# Altium schematic sheet Promless.SchDoc: FPGA Configuration and GBTx I/O
size A; Organization: UCLA High Energy Physics; DocumentNumber: 10; Revision: 2.0; SheetNumber: 10; SheetTotal: 23; CurrentDate: 9/6/2018; ModifiedDate: 9/6/2018
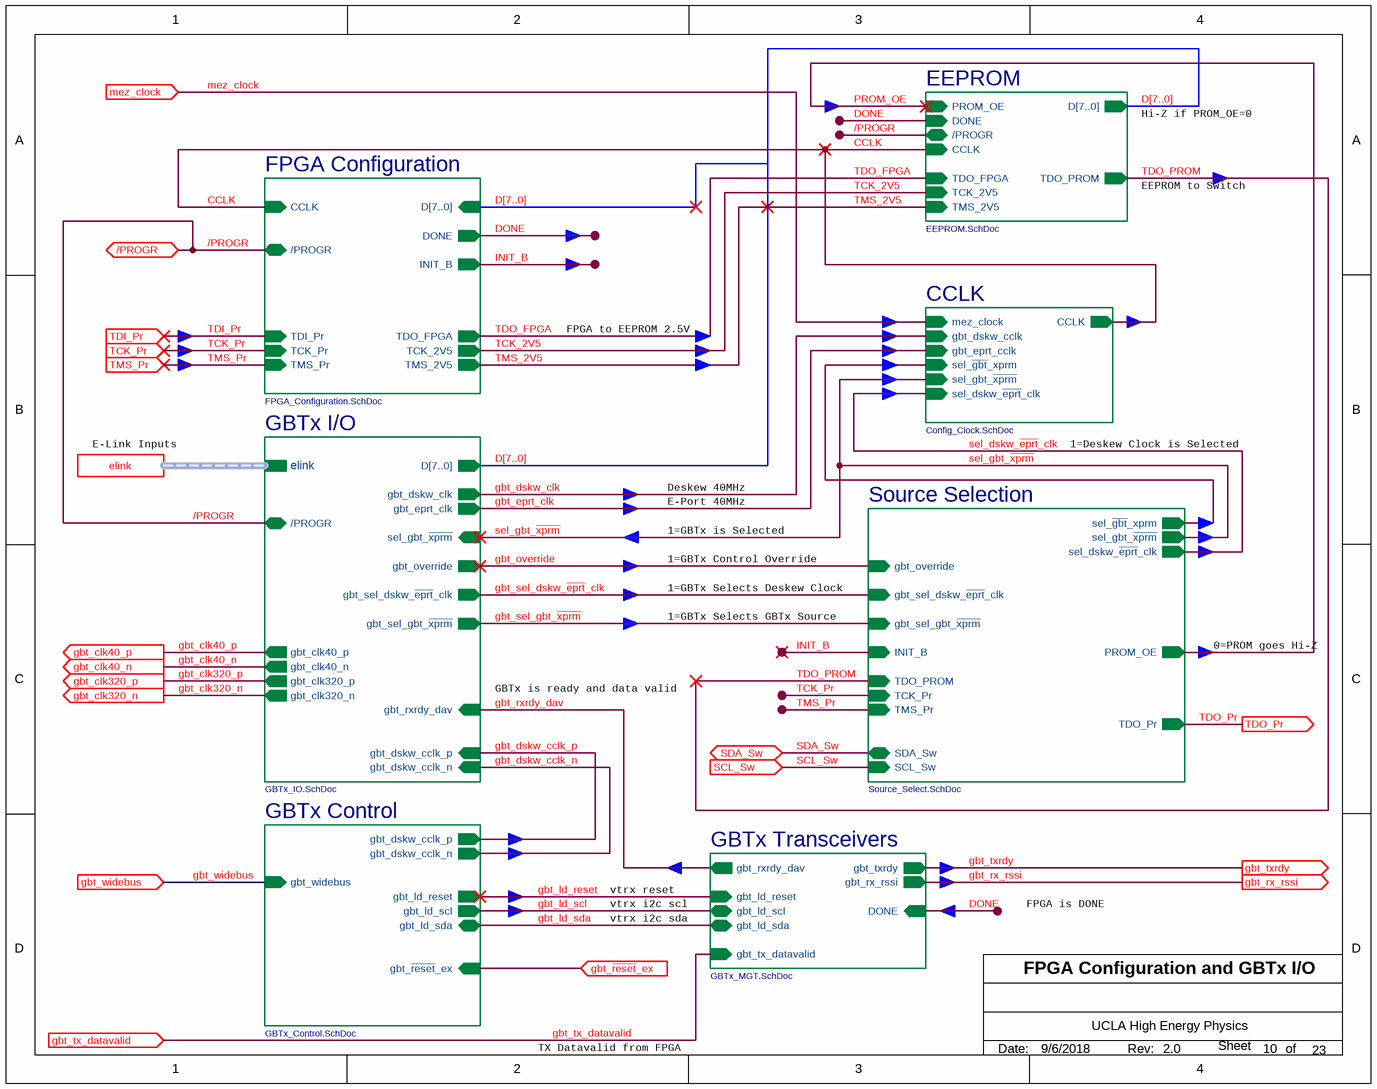
[diagram p0: Promless.SchDoc]

## Sub-sheets
CCLK = Config_Clock.SchDoc: CCLK (out), sel_gbt_~{xprm} (in), mez_clock (in), gbt_dskw_cclk (in), gbt_eprt_cclk (in), sel_dskw_~{eprt}_clk (in), sel_~{gbt}_xprm (in)
EEPROM = EEPROM.SchDoc: PROM_OE (in), DONE (in), /PROGR (bidir), D[7..0] (out), TCK_2V5 (in), TDO_FPGA (in), TMS_2V5 (in), TDO_PROM (out), CCLK (in)
FPGA Configuration = FPGA_Configuration.SchDoc: TDO_FPGA (out), TDI_Pr (in), TCK_Pr (in), TMS_Pr (in), /PROGR (bidir), DONE (out), CCLK (in), D[7..0] (in), TCK_2V5 (out), TMS_2V5 (out), INIT_B (out)
GBTx Control = GBTx_Control.SchDoc: gbt_dskw_cclk_p (out), gbt_dskw_cclk_n (out), gbt_ld_reset (out), gbt_ld_scl (out), gbt_ld_sda (bidir), gbt_widebus (in), gbt_~{reset}_ex (in)
GBTx I/O = GBTx_IO.SchDoc: D[7..0] (out), /PROGR (bidir), gbt_override (out), gbt_sel_dskw_~{eprt}_clk (out), gbt_eprt_clk (out), gbt_dskw_clk (out), gbt_sel_gbt_~{xprm} (out), sel_gbt_~{xprm} (in), gbt_dskw_cclk_p (in), gbt_dskw_cclk_n (in), gbt_rxrdy_dav (in), elink (harness E-Link), gbt_clk40_p (out), gbt_clk40_n (out), gbt_clk320_p (out), gbt_clk320_n (out)
GBTx Transceivers = GBTx_MGT.SchDoc: gbt_ld_scl (bidir), gbt_ld_sda (bidir), gbt_ld_reset (in), gbt_rx_rssi (out), gbt_tx_datavalid (in), gbt_rxrdy_dav (out), gbt_txrdy (out), DONE (in)
Source Selection = Source_Select.SchDoc: sel_gbt_~{xprm} (out), gbt_sel_dskw_~{eprt}_clk (in), TDO_PROM (in), TDO_Pr (out), SDA_Sw (bidir), SCL_Sw (in), TCK_Pr (in), TMS_Pr (in), gbt_override (in), INIT_B (in), PROM_OE (out), sel_dskw_~{eprt}_clk (out), gbt_sel_gbt_~{xprm} (in), sel_~{gbt}_xprm (out)

## Ports
/PROGR (bidir), elink (harness E-Link), gbt_clk40_n (out), gbt_clk40_p (out), gbt_clk320_n (out), gbt_clk320_p (out), gbt_rx_rssi (out), gbt_tx_datavalid (in), gbt_txrdy (out), gbt_widebus (in), gbt_~{reset}_ex (in), mez_clock (in), SCL_Sw (in), SDA_Sw (bidir), TCK_Pr (in), TDI_Pr (in), TDO_Pr (out), TMS_Pr (in)

## Nets
/PROGR: port /PROGR, sheet GBTx I/O//PROGR, sheet FPGA Configuration//PROGR, sheet EEPROM//PROGR
CCLK: sheet CCLK/CCLK, sheet FPGA Configuration/CCLK, sheet EEPROM/CCLK
DONE: sheet FPGA Configuration/DONE, sheet EEPROM/DONE, sheet GBTx Transceivers/DONE
gbt_clk40_n: port gbt_clk40_n, sheet GBTx I/O/gbt_clk40_n
gbt_clk40_p: port gbt_clk40_p, sheet GBTx I/O/gbt_clk40_p
gbt_clk320_n: port gbt_clk320_n, sheet GBTx I/O/gbt_clk320_n
gbt_clk320_p: port gbt_clk320_p, sheet GBTx I/O/gbt_clk320_p
gbt_dskw_cclk_n: sheet GBTx I/O/gbt_dskw_cclk_n, sheet GBTx Control/gbt_dskw_cclk_n
gbt_dskw_cclk_p: sheet GBTx I/O/gbt_dskw_cclk_p, sheet GBTx Control/gbt_dskw_cclk_p
gbt_dskw_clk: sheet CCLK/gbt_dskw_cclk, sheet GBTx I/O/gbt_dskw_clk
gbt_eprt_clk: sheet CCLK/gbt_eprt_cclk, sheet GBTx I/O/gbt_eprt_clk
gbt_ld_reset: sheet GBTx Control/gbt_ld_reset, sheet GBTx Transceivers/gbt_ld_reset
gbt_ld_scl: sheet GBTx Control/gbt_ld_scl, sheet GBTx Transceivers/gbt_ld_scl
gbt_ld_sda: sheet GBTx Control/gbt_ld_sda, sheet GBTx Transceivers/gbt_ld_sda
gbt_override: sheet Source Selection/gbt_override, sheet GBTx I/O/gbt_override
gbt_~{reset}_ex: port gbt_~{reset}_ex, sheet GBTx Control/gbt_~{reset}_ex
gbt_rx_rssi: port gbt_rx_rssi, sheet GBTx Transceivers/gbt_rx_rssi
gbt_rxrdy_dav: sheet GBTx I/O/gbt_rxrdy_dav, sheet GBTx Transceivers/gbt_rxrdy_dav
gbt_sel_dskw_~{eprt}_clk: sheet Source Selection/gbt_sel_dskw_~{eprt}_clk, sheet GBTx I/O/gbt_sel_dskw_~{eprt}_clk
gbt_sel_gbt_~{xprm}: sheet Source Selection/gbt_sel_gbt_~{xprm}, sheet GBTx I/O/gbt_sel_gbt_~{xprm}
gbt_tx_datavalid: port gbt_tx_datavalid, sheet GBTx Transceivers/gbt_tx_datavalid
gbt_txrdy: port gbt_txrdy, sheet GBTx Transceivers/gbt_txrdy
gbt_widebus: port gbt_widebus, sheet GBTx Control/gbt_widebus
INIT_B: sheet Source Selection/INIT_B, sheet FPGA Configuration/INIT_B
mez_clock: port mez_clock, sheet CCLK/mez_clock
PROM_OE: sheet Source Selection/PROM_OE, sheet EEPROM/PROM_OE
SCL_Sw: port SCL_Sw, sheet Source Selection/SCL_Sw
SDA_Sw: port SDA_Sw, sheet Source Selection/SDA_Sw
sel_dskw_~{eprt}_clk: sheet CCLK/sel_dskw_~{eprt}_clk, sheet Source Selection/sel_dskw_~{eprt}_clk
sel_gbt_~{xprm}: sheet CCLK/sel_gbt_~{xprm}, sheet Source Selection/sel_gbt_~{xprm}, sheet GBTx I/O/sel_gbt_~{xprm}
TCK_2V5: sheet FPGA Configuration/TCK_2V5, sheet EEPROM/TCK_2V5
TCK_Pr: port TCK_Pr, sheet Source Selection/TCK_Pr, sheet FPGA Configuration/TCK_Pr
TDI_Pr: port TDI_Pr, sheet FPGA Configuration/TDI_Pr
TDO_FPGA: sheet FPGA Configuration/TDO_FPGA, sheet EEPROM/TDO_FPGA
TDO_Pr: port TDO_Pr, sheet Source Selection/TDO_Pr
TDO_PROM: sheet Source Selection/TDO_PROM, sheet EEPROM/TDO_PROM
TMS_2V5: sheet FPGA Configuration/TMS_2V5, sheet EEPROM/TMS_2V5
TMS_Pr: port TMS_Pr, sheet Source Selection/TMS_Pr, sheet FPGA Configuration/TMS_Pr
(unnamed): sheet CCLK/sel_~{gbt}_xprm, sheet Source Selection/sel_~{gbt}_xprm

## Buses and harness runs
bus D[7..0] = sheet EEPROM/D[7..0] = sheet FPGA Configuration/D[7..0] = sheet GBTx I/O/D[7..0]
harness port elink = sheet GBTx I/O/elink

## Notes on the sheet
- Hi-Z if PROM_OE=0
- EEPROM to Switch
- FPGA to EEPROM 2.5V
- E-Link Inputs
- 1=Deskew Clock is Selected
- Deskew 40MHz
- E-Port 40MHz
- 1=GBTx is Selected
- 1=GBTx Selects Deskew Clock
- 1=GBTx Control Override
- 1=GBTx Selects GBTx Source
- 0=PROM goes Hi-Z
- GBTx is ready and data valid
- vtrx reset
- vtrx i2c scl
- vtrx i2c sda
- FPGA is DONE
- TX Datavalid from FPGA
- Date:
- Rev:
- of
- Sheet